# EAGLE design libTest (EAGLE 6.6.0)
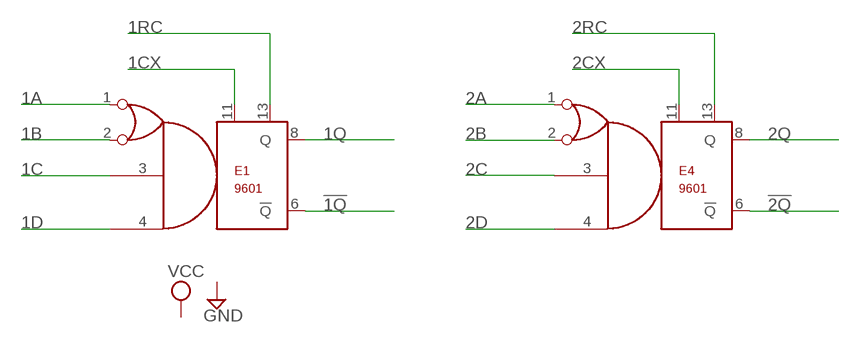
[diagram p0: schematic, sheet 1]

## Parts
E1  9601  [DIL14]
E4  9601  [DIL14]

## Nets
1A: E1.1
1B: E1.2
1C: E1.3
1CX: E1.11
1D: E1.4
1Q: E1.8(Q)
1RC: E1.13
2A: E4.1
2B: E4.2
2C: E4.3
2CX: E4.11
2D: E4.4
2Q: E4.8(Q)
2RC: E4.13
!1Q: E1.6(!Q)
!2Q: E4.6(!Q)

## Power pins joined to a net without a drawn wire
GND: E1.7(GND) E4.7(GND)
VCC: E1.14(VCC) E4.14(VCC)

## Library data of the parts
E1 E4 = dec-con:9601: DEC9601 monstable

## Board
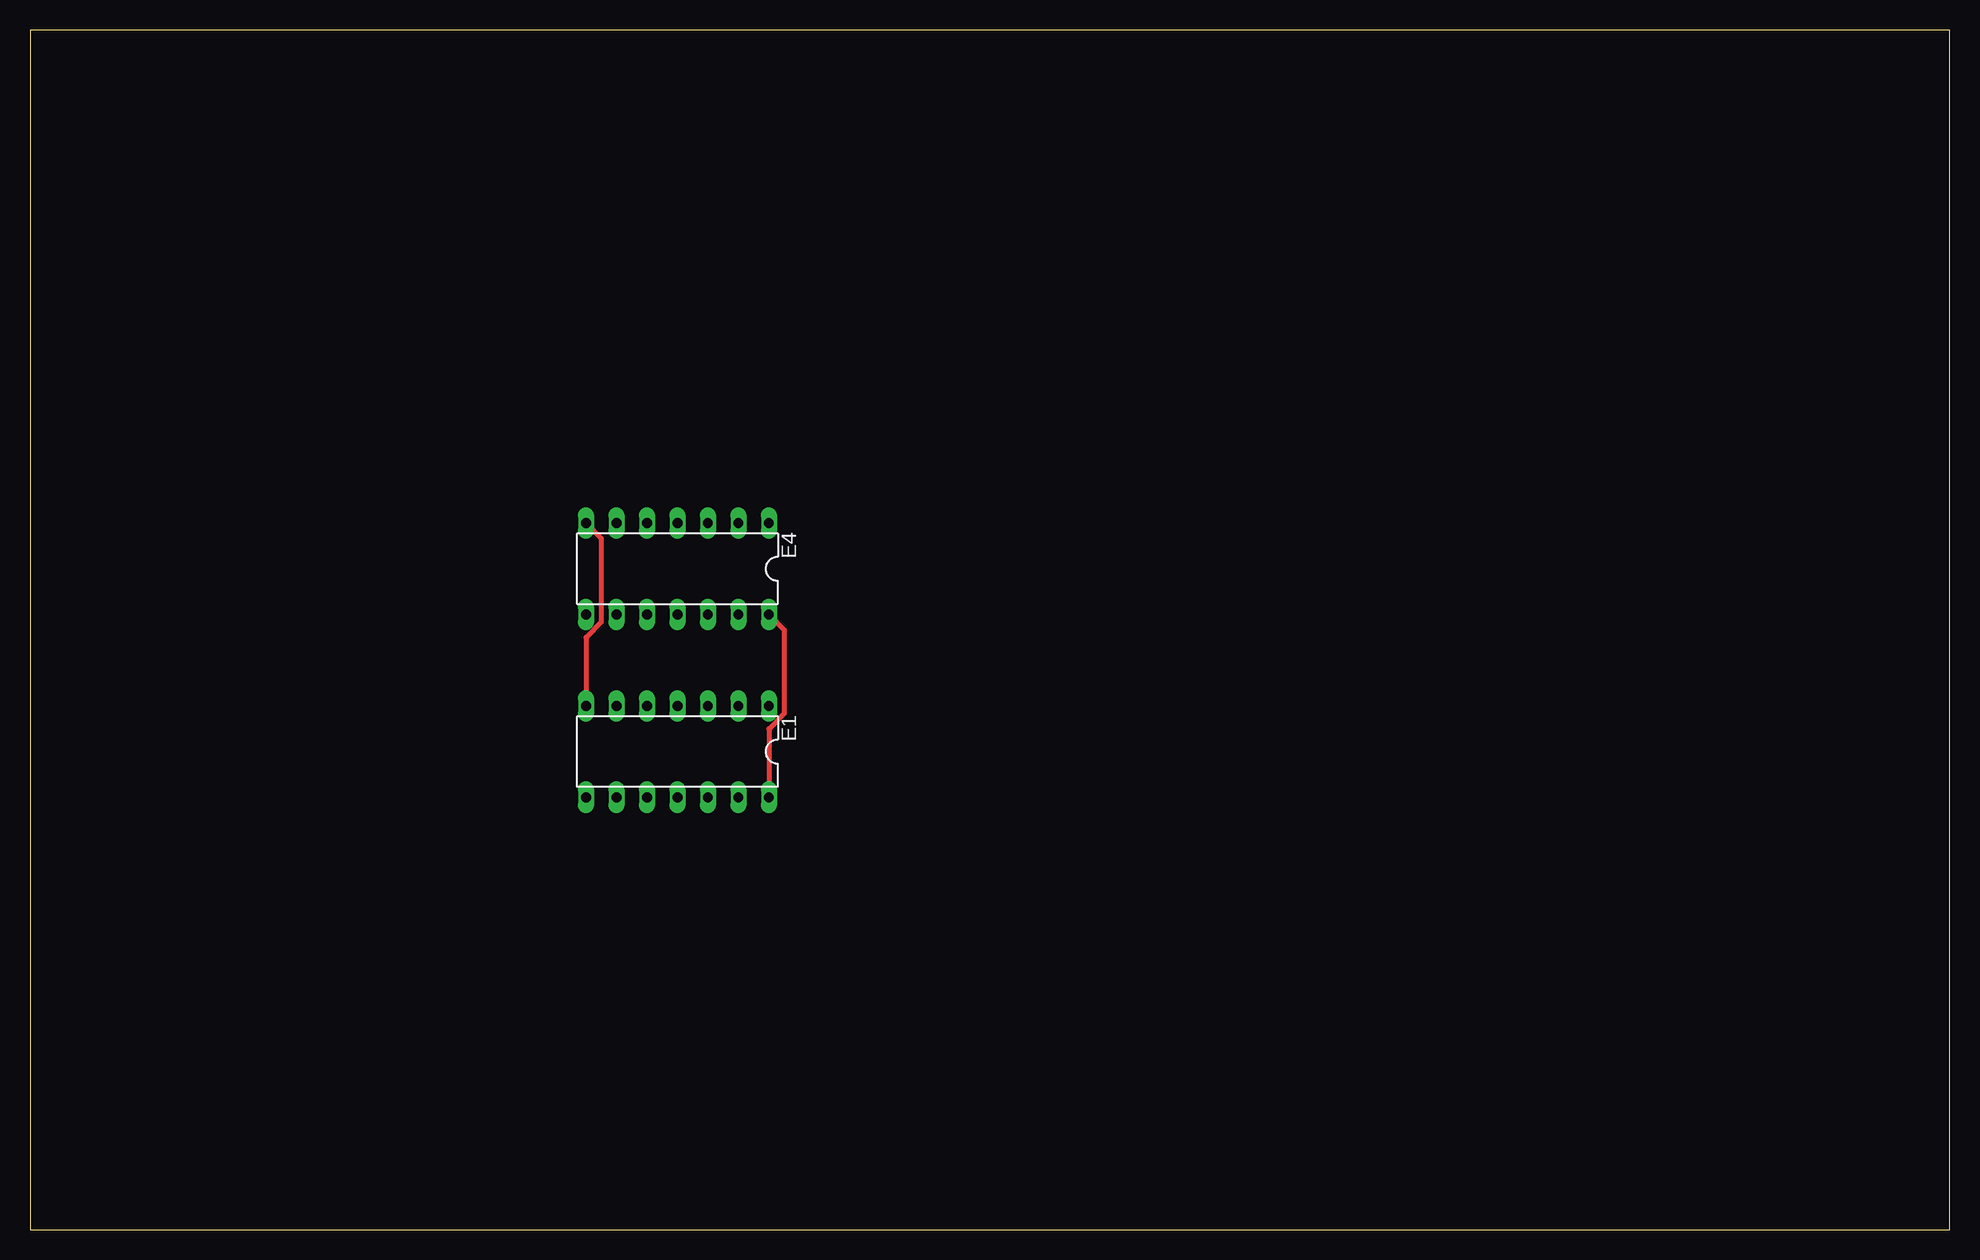
[diagram p1: board, top side]

Size 160 x 100 mm. Coordinates in mm from the lower left corner, seen from the top.
Outline: 0,0 160,0 160,100 0,100 0,0
Copper layers (1+16): Top 0.035mm / dielectric 1.5mm / Bottom 0.035mm
Design rules "16mils": minimum track width 16mil, minimum drill 32mil, track to track 15mil, track to pad 10mil, pad to pad 10mil, via to via 10mil, smd to smd 10mil, copper to edge 13mil, drill to drill 10mil, minimum pad ring 10mil, minimum via ring 8mil, stop-mask expansion 0mil, vias tented up to drill 0mil, thermal gap 10mil

### Footprints (pad centres in the part's own frame; a part is rotated, then mirrored left to right if it is on the bottom)
DIL14 = drill 0.813 long: 1 -7.62,-3.81; 2 -5.08,-3.81; 3 -2.54,-3.81; 4 0,-3.81; 5 2.54,-3.81; 6 5.08,-3.81; 7 7.62,-3.81; 8 7.62,3.81; 9 5.08,3.81; 10 2.54,3.81; 11 0,3.81; 12 -2.54,3.81; 13 -5.08,3.81; 14 -7.62,3.81

### Placement (x,y rotation side)
E1  53.97,39.84 180 top
E4  53.97,55.08 180 top

### Tracks (layer width: path | path; a pad name or v marks a point on that pad's centre or on a via)
GND
  Top 0.406: E1.7 46.35,49.37 47.62,50.63 47.62,57.62 E4.7
VCC
  Top 0.406: E1.14 61.59,41.74 62.86,43.02 62.86,50 E4.14